# Altium schematic sheet knixx_HAT_00.SchDoc: knixx RPi HAT
size A3; Date: 1-8-2016; DrawnBy: Wim Van Gool; Revision: 00; SheetNumber: 1; SheetTotal: 1
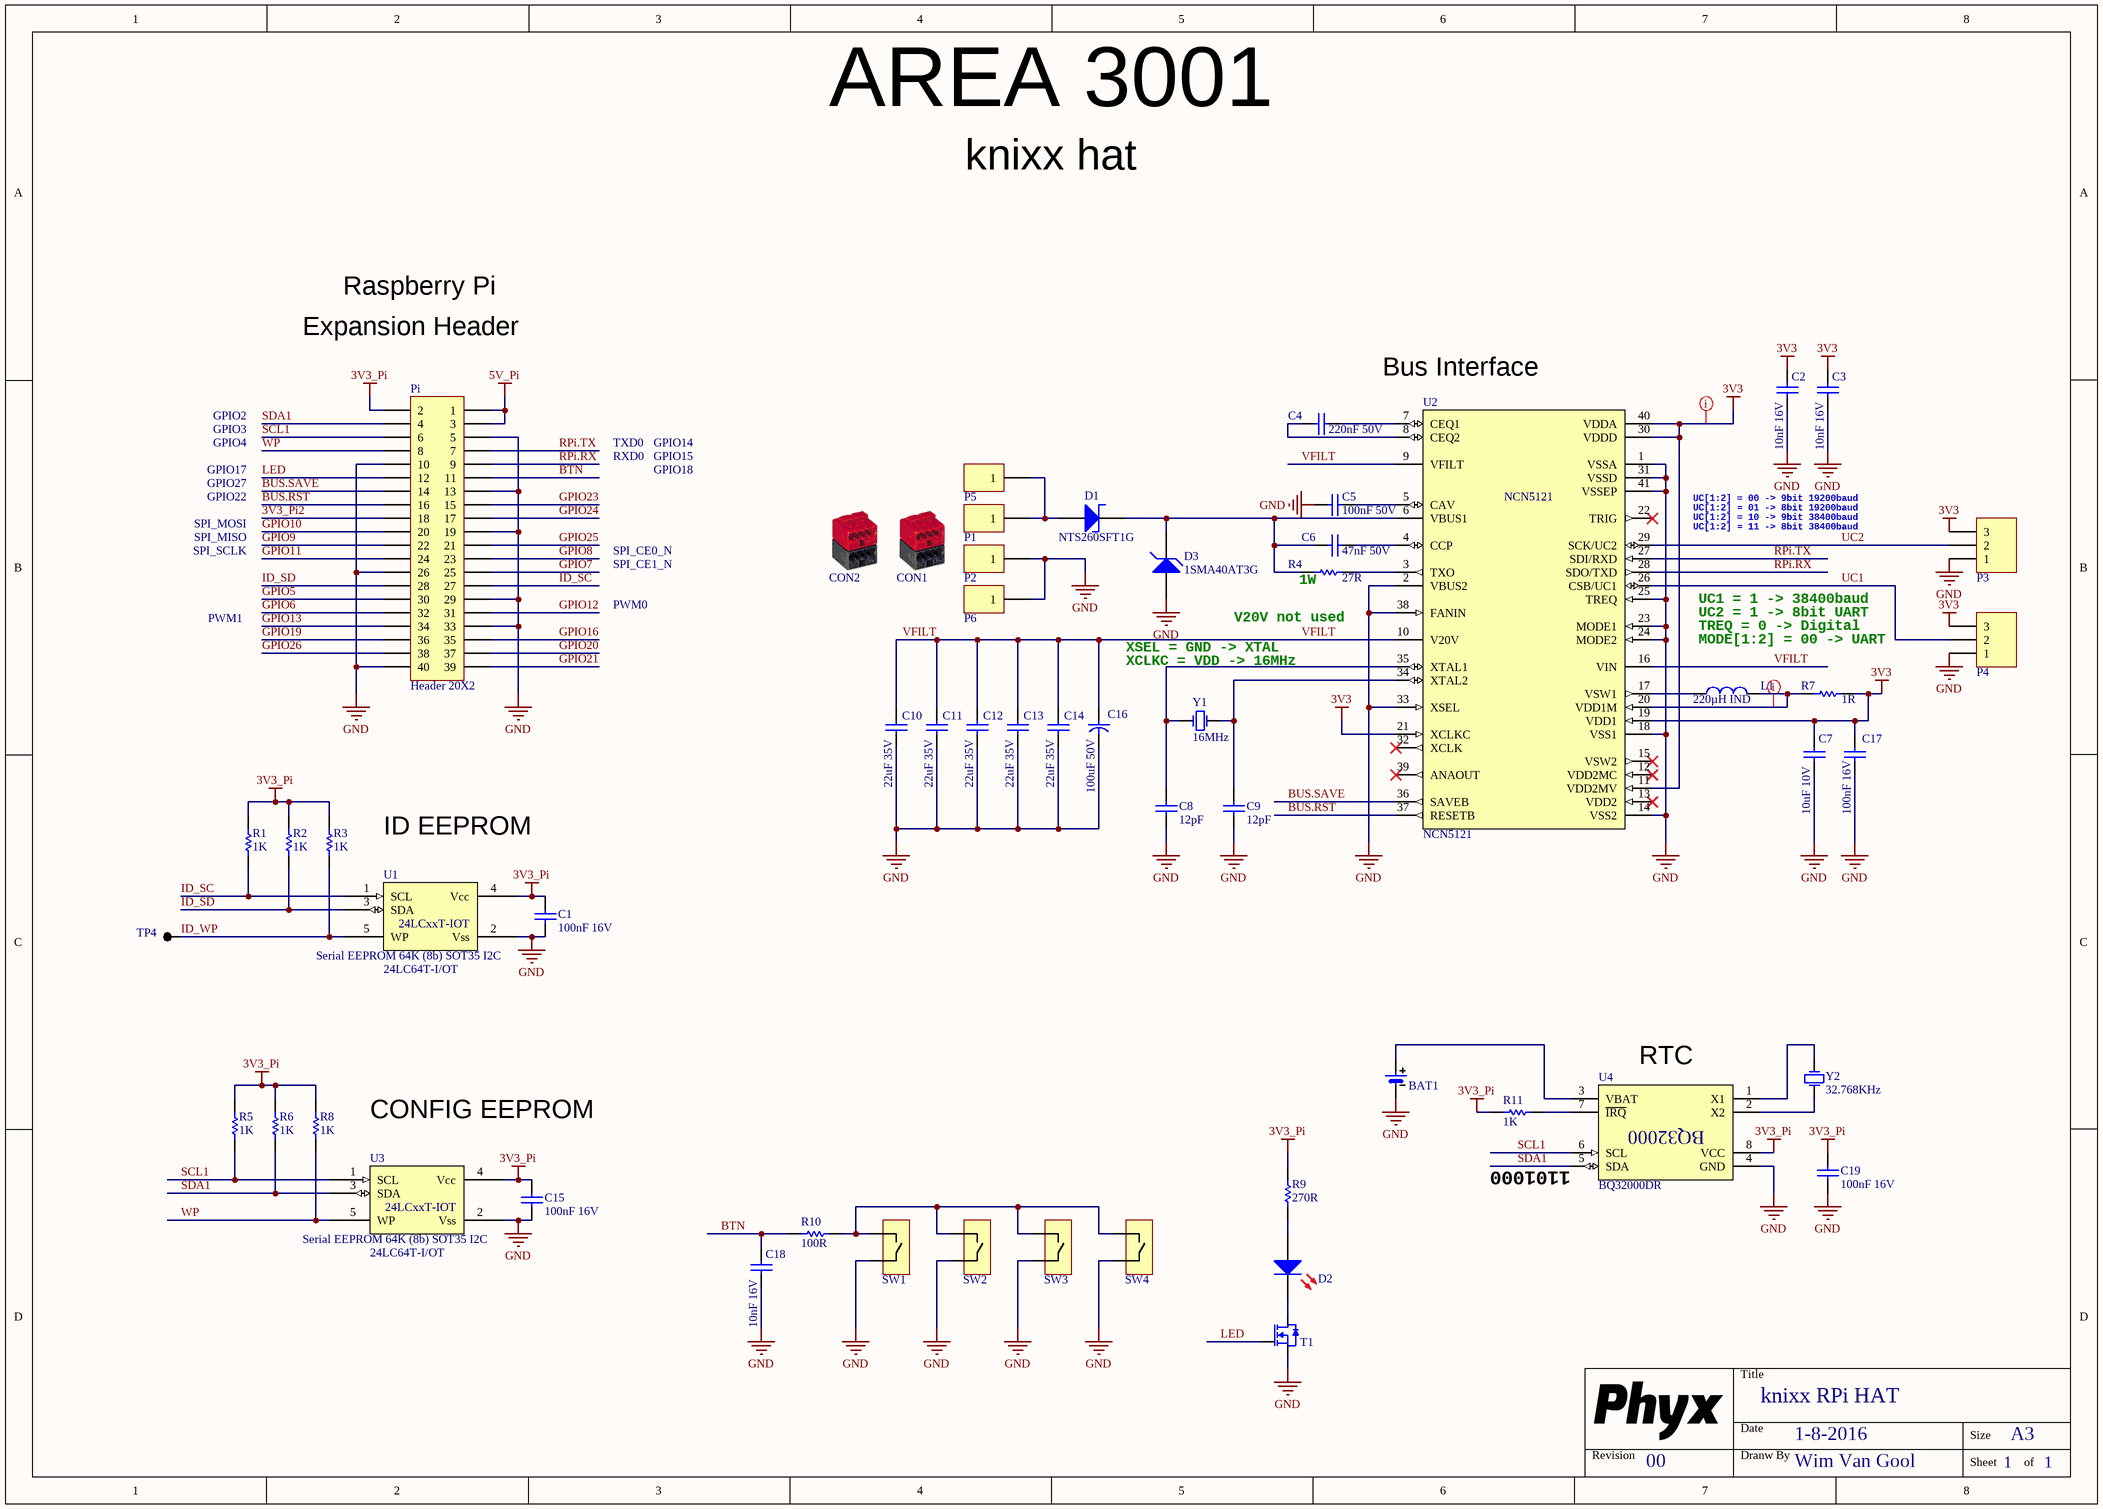
[diagram p0: knixx_HAT_00.SchDoc]

## Parts
BAT1  BR-1220/HFN 35mAh  [BR-1220_HFN]  (value not drawn)
C1  value 100nF 16V  [C0603_N]  (hidden comment: CAP_CERAMIC)
C2  value 10nF 16V  [C0603_N]  (hidden comment: CAP_CERAMIC)
C3  value 10nF 16V  [C0603_N]  (hidden comment: CAP_CERAMIC)
C4  value 220nF 50V  [C0805_N]  (hidden comment: CAP_CERAMIC)
C5  value 100nF 50V  [C0603_N]  (hidden comment: CAP_CERAMIC)
C6  value 47nF 50V  [C0603_N]  (hidden comment: CAP_CERAMIC)
C7  value 10uF 10V  [C0805_N]  (hidden comment: CAP_CERAMIC)
C8  value 12pF  [C0603_N]  (hidden comment: CAP_CERAMIC)
C9  value 12pF  [C0603_N]  (hidden comment: CAP_CERAMIC)
C10  value 22uF 35V  [C1206_N]  (hidden comment: CAP_CERAMIC)
C11  value 22uF 35V  [C1206_N]  (hidden comment: CAP_CERAMIC)
C12  value 22uF 35V  [C1206_N]  (hidden comment: CAP_CERAMIC)
C13  value 22uF 35V  [C1206_N]  (hidden comment: CAP_CERAMIC)
C14  value 22uF 35V  [C1206_N]  (hidden comment: CAP_CERAMIC)
C15  value 100nF 16V  [C0603_N]  (hidden comment: CAP_CERAMIC)
C16  value 100uF 50V  [C_8x11.5_3.5mm]  (hidden comment: CAP_POL)
C17  value 100nF 16V  [C0603_N]  (hidden comment: CAP_CERAMIC)
C18  value 10nF 16V  [C0603_N]  (hidden comment: CAP_CERAMIC)
C19  value 100nF 16V  [C0603_N]  (hidden comment: CAP_CERAMIC)
CON1  CONNECTOR FOR EIB APPLICATIONS PUSH-WIRE® CONNECTION  [WAGO_243-211]  (value not drawn)
CON2  CONNECTOR FOR EIB APPLICATIONS PUSH-WIRE® CONNECTION  [WAGO_243-211]  (value not drawn)
D1  value NTS260SFT1G  [ON_SOD-123FL]  (hidden comment: NTS260SFT1G  Schottky Rectifier, Single, 60 V, 2 A, SOD-123, 650 mV)
D2  Default 0805 Red LED  [LED_0805_RD]  (value not drawn)
D3  value 1SMA40AT3G  [SMA_AC]  (hidden comment: TVS Diode 40V 400W Unidirectional DO-214AC)
L1  value 220µH IND  [IND_6045]  (hidden comment: 220µH INDUCTOR)
P1  SOLDER PIN FOR PCBS UP TO 2 MM  [WAGO_243-131]  (value not drawn)
P2  SOLDER PIN FOR PCBS UP TO 2 MM  [WAGO_243-131]  (value not drawn)
P3  Header 3  [HDR1X3]  (value not drawn)
P4  Header 3  [HDR1X3]  (value not drawn)
P5  SOLDER PIN FOR PCBS UP TO 2 MM  [WAGO_243-131]  (value not drawn)
P6  SOLDER PIN FOR PCBS UP TO 2 MM  [WAGO_243-131]  (value not drawn)
Pi  Header 20X2  [RCPT2X20]
R1  value 1K  [R0603_N]  (hidden comment: RESISTOR)
R2  value 1K  [R0603_N]  (hidden comment: RESISTOR)
R3  value 1K  [R0603_N]  (hidden comment: RESISTOR)
R4  value 27R  [R2512]  (hidden comment: RESISTOR)
R5  value 1K  [R0603_N]  (hidden comment: RESISTOR)
R6  value 1K  [R0603_N]  (hidden comment: RESISTOR)
R7  value 1R  [R0603_N]  (hidden comment: RESISTOR)
R8  value 1K  [R0603_N]  (hidden comment: RESISTOR)
R9  value 270R  [R0603_N]  (hidden comment: RESISTOR)
R10  value 100R  [R0603_N]  (hidden comment: RESISTOR)
R11  value 1K  [R0603_N]  (hidden comment: RESISTOR)
SW1  LP RA SMD tact sw W/BOSS  [EVQP7M01K]  (value not drawn)
SW2  Default TH TACT  [TACTSW]  (value not drawn)
SW3  LP RA SMD tact sw W/BOSS  [EVQP7M01K]  (value not drawn)
SW4  Default TH TACT  [TACTSW]  (value not drawn)
T1  0.2A N-Ch MOSFET Vgs 3.2  [SOT23-3]  (value not drawn)
TP4  TEST_PAD  [TP_1.2mm_0.6mm]  (value not drawn)
U1  Serial EEPROM 64K (8b) SOT35 I2C  value 24LC64T-I/OT  [SOT23-5]
U2  value NCN5121  [ONS_QFN40_6x6]  (hidden comment: KNX Transceiver for Twisted Pair Networks)
U3  Serial EEPROM 64K (8b) SOT35 I2C  value 24LC64T-I/OT  [SOT23-5]
U4  value BQ32000DR  [SOIC_N_8]  (hidden comment: I2C RTC Ti BQ32000)
Y1  value 16MHz  [HC49US_SMD]  (hidden comment: 16MHz 20pF HC49S Fox)
Y2  value 32.768KHz  [CMR200T]  (hidden comment: 32.768Khz CMR200 12.5pF)

## Nets
3V3: C2.1 C3.1 C7.1 C17.1 P3.3 P4.3 R7.1 U2.11(VDD2MV) U2.19(VDD1) U2.21(XCLKC) U2.30(VDDD) U2.40(VDDA)
3V3_Pi: C1.1 C15.1 C19.1 Pi.2 R1.1 R2.1 R3.1 R5.1 R6.1 R8.1 R9.1 R11.1 U1.4(Vcc) U3.4(Vcc) U4.8(VCC)
5V_Pi: Pi.1 Pi.3
GND: BAT1.2 C1.2 C2.2 C3.2 C5.2 C7.2 C8.2 C9.2 C10.2 C11.2 C12.2 C13.2 C14.2 C15.2 C16.2 C17.2 C18.2 C19.2 D3.A P2.1 P3.1 P4.1 P6.1 Pi.5 Pi.10 Pi.13 Pi.19 Pi.26 Pi.29 Pi.33 Pi.40 SW1.2 SW2.2 SW3.2 SW4.2 T1.2(S) U1.2(Vss) U2.1(VSSA) U2.2(VBUS2) U2.14(VSS2) U2.18(VSS1) U2.23(MODE1) U2.24(MODE2) U2.25(TREQ) U2.31(VSSD) U2.33(XSEL) U2.38(FANIN) U2.41(VSSEP) U3.2(Vss) U4.4(GND)
3V3_Pi2: Pi.18
BTN: C18.1 Pi.11 R10.2
BUS.RST: Pi.16 U2.37(RESETB)
BUS.SAVE: Pi.14 U2.36(SAVEB)
GPIO5: Pi.30
GPIO6: Pi.32
GPIO7: Pi.25
GPIO8: Pi.23
GPIO9: Pi.22
GPIO10: Pi.20
GPIO11: Pi.24
GPIO12: Pi.31
GPIO13: Pi.34
GPIO16: Pi.35
GPIO19: Pi.36
GPIO20: Pi.37
GPIO21: Pi.39
GPIO23: Pi.15
GPIO24: Pi.17
GPIO25: Pi.21
GPIO26: Pi.38
ID_SC: Pi.27 R1.2 U1.1(SCL)
ID_SD: Pi.28 R2.2 U1.3(SDA)
ID_WP: R3.2 TP4.1 U1.5(WP)
LED: Pi.12 T1.1(G)
RPi.RX: Pi.9 U2.28(SDO/TXD)
RPi.TX: Pi.7 U2.27(SDI/RXD)
SCL1: Pi.6 R5.2 U3.1(SCL) U4.6(SCL)
SDA1: Pi.4 R6.2 U3.3(SDA) U4.5(SDA)
UC1: P4.2 U2.26(CSB/UC1)
UC2: P3.2 U2.29(SCK/UC2)
VFILT: C10.1 C11.1 C12.1 C13.1 C14.1 C16.1 U2.9(VFILT) U2.10(V20V) U2.16(VIN)
WP: Pi.8 R8.2 U3.5(WP)
NetBAT1_1: BAT1.1 U4.3(VBAT)
NetC4_1: C4.1 U2.7(CEQ1)
NetC4_2: C4.2 U2.8(CEQ2)
NetC5_1: C5.1 U2.5(CAV)
NetC6_1: C6.1 U2.4(CCP)
NetC6_2: C6.2 D1.1(C) D3.C R4.2 U2.6(VBUS1)
NetC8_1: C8.1 U2.35(XTAL1) Y1.1(OSC1)
NetC9_1: C9.1 U2.34(XTAL2) Y1.2(OSC2)
NetD1_2: D1.2(A) P1.1 P5.1
NetD2_1: D2.1(A) R9.2
NetD2_2: D2.2(K) T1.3(D)
NetL1_1: L1.1 U2.17(VSW1)
NetL1_2: L1.2 R7.2 U2.20(VDD1M)
NetR4_1: R4.1 U2.3(TXO)
NetR10_1: R10.1 SW1.1 SW2.1 SW3.1 SW4.1
NetR11_2: R11.2 U4.7(~{IRQ})
NetU4_1: U4.1(X1) Y2.2(OSC2)
NetU4_2: U4.2(X2) Y2.1(OSC1)

Not connected (* = marked no-connect by the designer): U2 12(VDD2MC)* 13(VDD2)* 15(VSW2)* 22(TRIG)* 32(XCLK)* 39(ANAOUT)*

## Layout directives
net class POWER: 3V3, NetL1_2

## Notes on the sheet
- AREA 3001
- knixx hat
- Raspberry Pi
- Expansion Header
- (near U2) Bus Interface
- GPIO2
- GPIO3
- GPIO4
- TXD0
- GPIO14
- GPIO17
- GPIO27
- GPIO22
- RXD0
- GPIO18
- GPIO15
- UC[1:2] = 00 -> 9bit 19200baud
- UC[1:2] = 01 -> 8bit 19200baud
- UC[1:2] = 10 -> 9bit 38400baud
- SPI_MOSI
- SPI_MISO
- SPI_SCLK
- SPI_CE0_N
- SPI_CE1_N
- (near R4) 1W
- UC[1:2] = 11 -> 8bit 38400baud
- PWM1
- PWM0
- XSEL = GND -> XTAL
- (near R4) V20V not used
- TREQ = 0 -> Digital
- MODE[1:2] = 00 -> UART
- UC1 = 1 -> 38400baud
- UC2 = 1 -> 8bit UART
- XCLKC = VDD -> 16MHz
- ID EEPROM
- CONFIG EEPROM
- (near U4) RTC
- (near U4) 1101000
- Title
- Revision
- Date
- Dranw By
- Size
- A3
- Sheet
- of

## Library data of the parts
BAT1 = BAT BR-1220/HFN: =Description; Value: 1220; Supplier 1: Farnell; Supplier Part Number 1: 1892653
C1 C15 C17 C19 = CAP # 100nF 16V 0603: Capacitor Ceramic
C2 C3 C18 = CAP # 10nF 16V 0603: Capacitor Ceramic
C4 = CAP # 220nF 50V 0805: Capacitor Ceramic; Supplier 1: Farnell; Supplier Part Number 1: 2496964
C5 = CAP # 100nF 50V 0603: Capacitor Ceramic; Supplier 1: Farnell; Supplier Part Number 1: 1759122
C6 = CAP # 47nF 50V 0603: Capacitor Ceramic; Supplier 1: Farnell; Supplier Part Number 1: 2496867
C7 = CAP # 10uF 10V 0805: Capacitor Ceramic; Supplier 1: Farnell; Supplier Part Number 1: 2320859
C8 C9 = CAP # 12pF 50V 0402: Capacitor Ceramic; Supplier 1: Farnell; Supplier Part Number 1: 2310489
C10-C14 = CAP # 22uF 35V 1206 X5R: Capacitor Ceramic; Supplier 1: Digikey; Supplier Part Number 1: 445-8045-1-ND
C16 = CAP 100uF 50V 8x11mm: Capacitor electrolyt; Supplier 1: Farnell; Supplier Part Number 1: 9693793
CON1 CON2 = Wago 243-211 Connector EIB: Value: 243-211
D1 = Schottky # NTS260SFT1G: =Description; Supplier 1: Farnell; Supplier Part Number 1: 2473419
D2 = LED # Red 0805: =Description; Supplier 1: Farnell; Supplier Part Number 1: 2099236
D3 = TVS # UNI 40V 1SMA40AT3G: =Description; Supplier 1: Farnell; Supplier Part Number 1: 2533119
L1 = IND # 10uH 5.2x5.2mm SRU5028-100Y: Supplier 1: Farnell; Supplier Part Number 1: xxx
P1 P2 P5 P6 = Wago 234-131 Solder pin: Value: 243-131
P3 P4 = Pin Header 2.54mm 3way
Pi = Receptable 2.54mm dual row 40way: =Description
R1-R3 R5 R6 R8 R11 = RES # 1K 0603
R4 = RES # 27R 2512
R7 = RES # 1R 0402
R9 = RES # 270R 0603: Supplier 1: Farnell; Supplier Part Number 1: 2497841
R10 = RES # 100R 0603
SW1 SW3 = SW # EVQP7M01K: Value: EVQP7M01K; Supplier 1: Farnell
SW2 SW4 = SW TACT
T1 = BSS138 N-Ch MOSFET 0.2A 3.2Vgs 60Vds: Value: BSS138; Supplier 1: Farnell; Supplier Part Number 1: 2432717
TP4 = TP 1.2mm: Value: NO BOM
U1 U3 = EEPROM # I2C 8Kx8b 24LC64T-I/OT: =Description; Supplier 1: Farnell; Supplier Part Number 1: 1700992
U2 = KNX # NCN5121: =Description
U4 = RTC # BQ32000: =Description; Supplier 1: Farnell; Supplier Part Number 1: 1754773
Y1 = XTAL # 16Mhz HC49S: Crystal Oscillator; Supplier 1: Farnell; Supplier Part Number 1: 2058001
Y2 = XTAL # 32.768Khz 12.5pF CMR200: Crystal Oscillator; Supplier 1: Farnell; Supplier Part Number 1: 2101359